# EAGLE schematic sense1-vlaqc-rev5-test-jig-CCS (EAGLE 9.0.1)
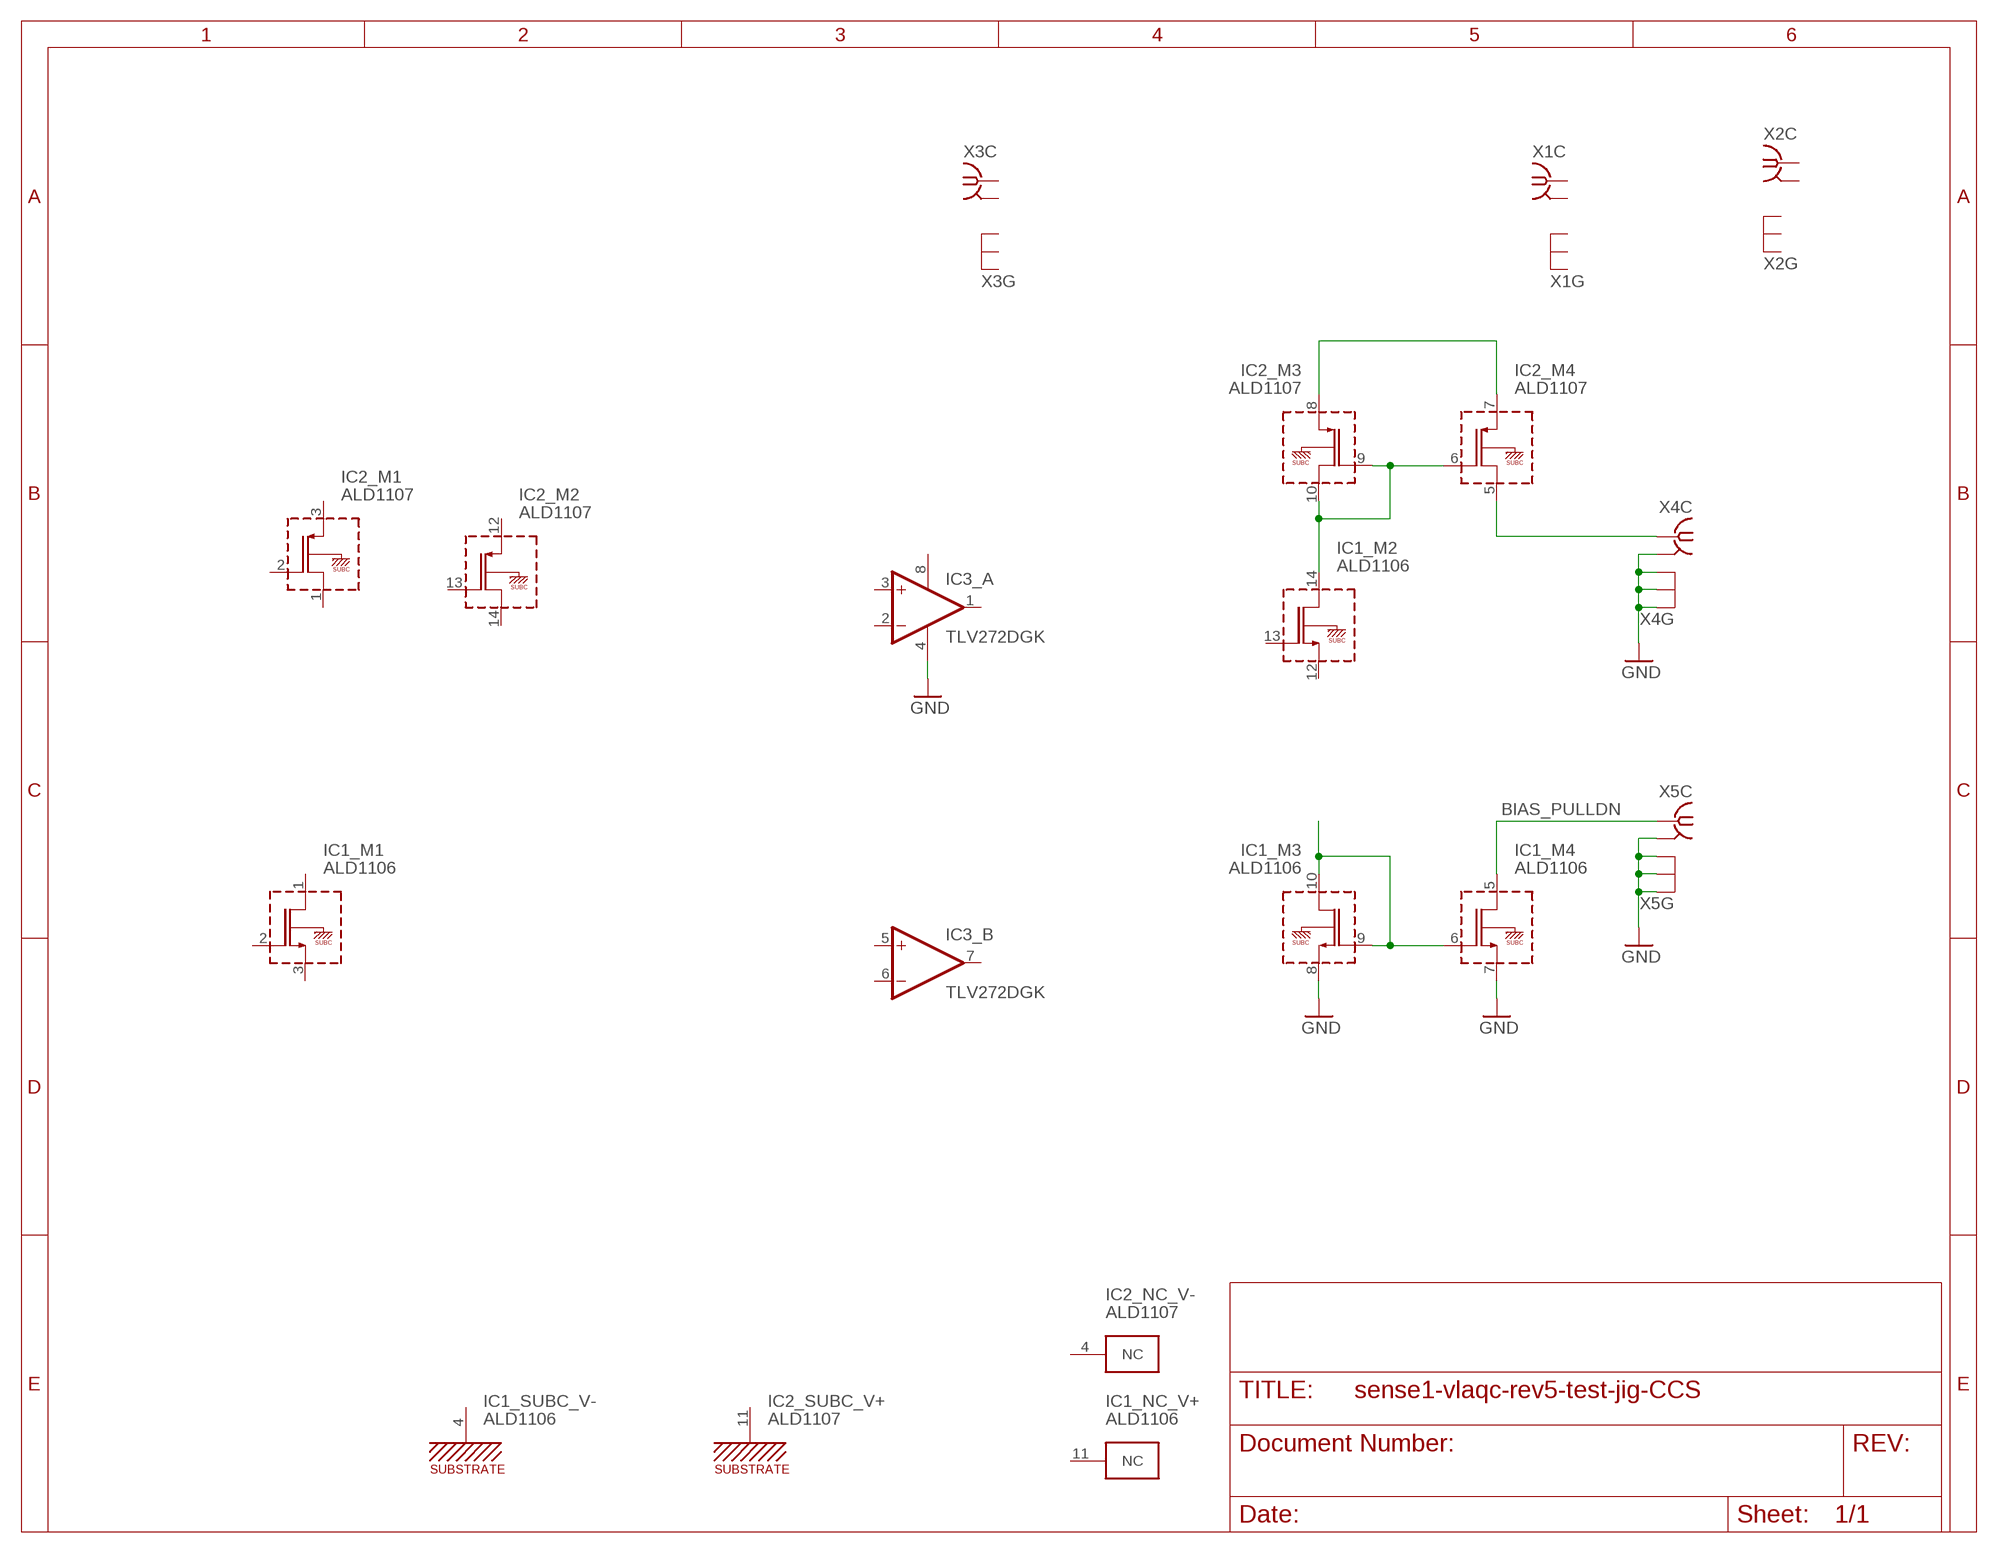
[diagram p0: schematic, sheet 1]

## Parts
IC1  ALD1106  [SO14]
IC2  ALD1107  [SO14]
IC3  TLV272DGK  [MSOP8]
X1  MMCXBIGPAD  [MMCX-SMT-BIGPADS]
X2  MMCXBIGPAD  [MMCX-SMT-BIGPADS]
X3  MMCXBIGPAD  [MMCX-SMT-BIGPADS]
X4  MMCXBIGPAD  [MMCX-SMT-BIGPADS]
X5  MMCXBIGPAD  [MMCX-SMT-BIGPADS]

## Nets
BIAS_PULLDN: IC1.5(_M4:D) X5.S
GND: IC1.7(_M4:S) IC1.8(_M3:S) IC3.4(_A:V-) X4.G1(C:GND) X4.G2(G:GND) X4.G3(G:GND) X4.G4(G:GND) X5.G1(C:GND) X5.G2(G:GND) X5.G3(G:GND) X5.G4(G:GND)
N$1: IC2.5(_M4:D) X4.S
N$2: IC1.14(_M2:D) IC2.6(_M4:G) IC2.9(_M3:G) IC2.10(_M3:D)
N$3: IC1.6(_M4:G) IC1.9(_M3:G) IC1.10(_M3:D)
N$5: IC2.7(_M4:S) IC2.8(_M3:S)
Unconnected: IC1.1(_M1:D) IC1.2(_M1:G) IC1.3(_M1:S) IC1.4(_SUBC_V-:SUBC) IC1.11(_NC_V+:NC) IC1.12(_M2:S) IC1.13(_M2:G) IC2.1(_M1:D) IC2.2(_M1:G) IC2.3(_M1:S) IC2.4(_NC_V-:NC) IC2.11(_SUBC_V+:SUBC) IC2.12(_M2:S) IC2.13(_M2:G) IC2.14(_M2:D) IC3.1(_A:OUT) IC3.2(_A:-IN) IC3.3(_A:+IN) IC3.5(_B:+IN) IC3.6(_B:-IN) IC3.7(_B:OUT) X1.S X2.S X3.S

## Power pins joined to a net without a drawn wire
GND: X1.G1(C:GND) X1.G2(G:GND) X1.G3(G:GND) X1.G4(G:GND) X2.G1(C:GND) X2.G2(G:GND) X2.G3(G:GND) X2.G4(G:GND) X3.G1(C:GND) X3.G2(G:GND) X3.G3(G:GND) X3.G4(G:GND)
V+: IC3.8(_A:V+)

## Library data of the parts
IC1 = meng:ALD1106
IC2 = meng:ALD1107
IC3 = meng:TLV272
X1-X5 = meng:MMCX